# Altium schematic sheet OSSI-1 LED Controller_1.SchDoc: TITLE:
size 410 x 286 mm; Date: Date:; >LAST_DATE_TIME: 01/11/2015 13:36:10; Sheet:: Sheet:; >SHEET: 2; REV:: REV:; Document Number:: Document Number:; >DRAWING_NAME: OSSI-1 LED Controller.sch
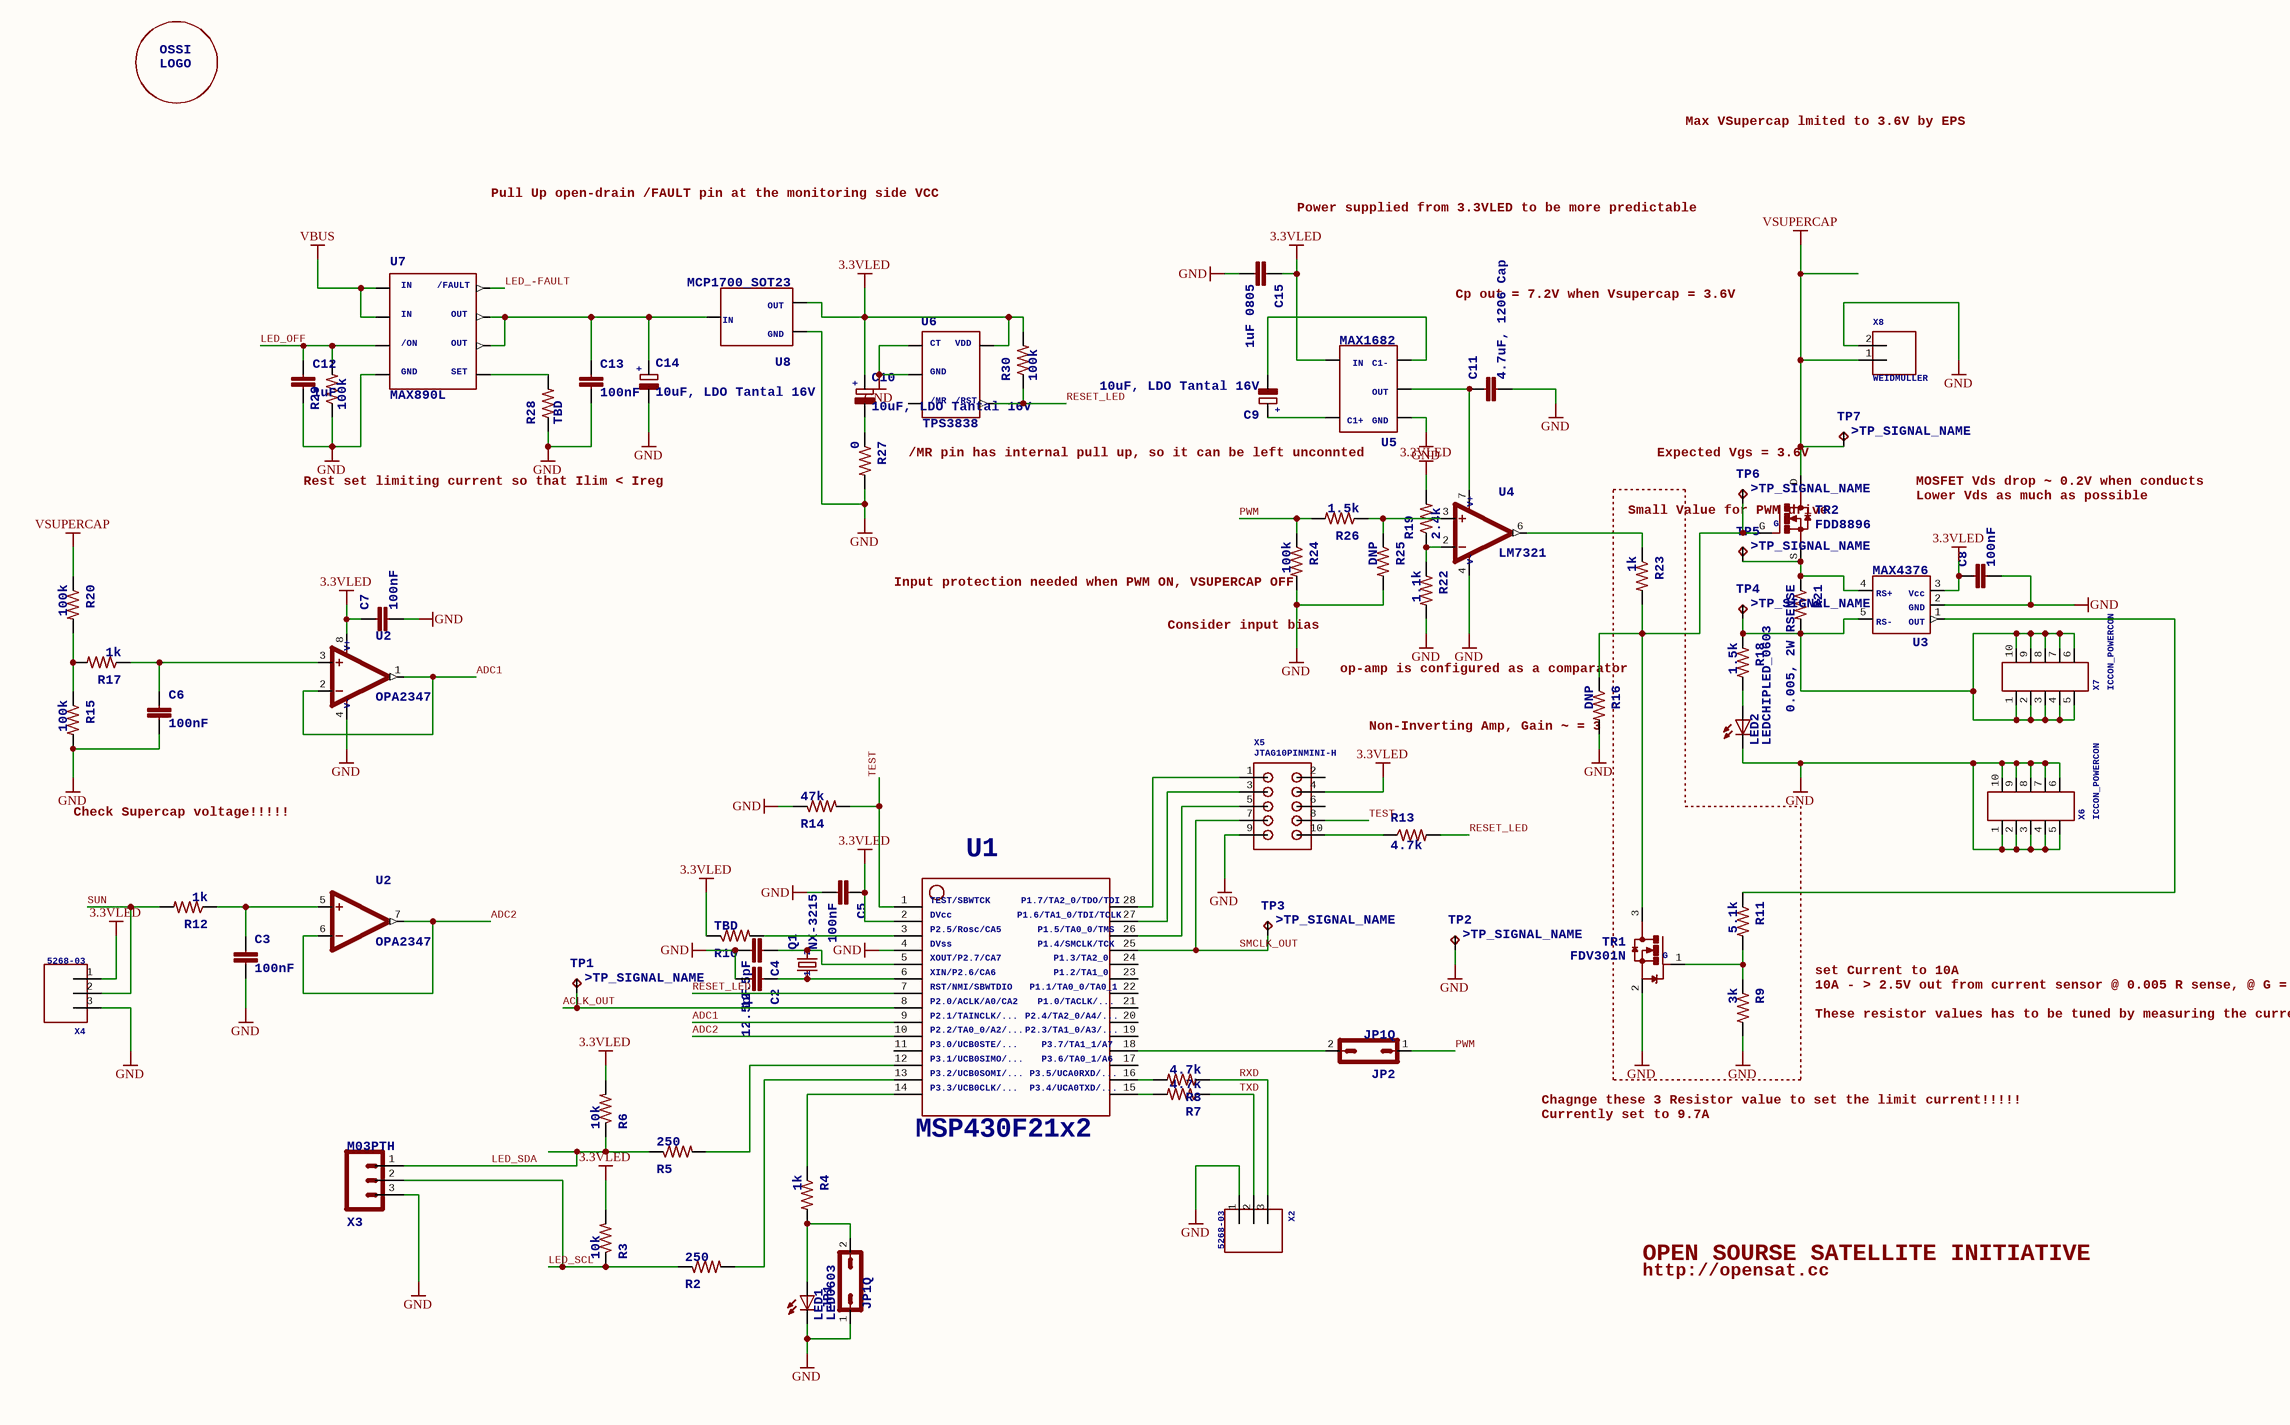
[diagram p0: OSSI-1 LED Controller_1.SchDoc]

## Parts
C2  >NAME: C2  [C0603(1608)]  (hidden comment: 12.5pF)
C3  >NAME: C3  [C0603(1608)]  (hidden comment: 100nF)
C4  >NAME: C4  [C0603(1608)]  (hidden comment: 12.5pF)
C5  >NAME: C5  [C0603(1608)]  (hidden comment: 100nF)
C6  >NAME: C6  [C0603(1608)]  (hidden comment: 100nF)
C7  >NAME: C7  [C0603(1608)]  (hidden comment: 100nF)
C8  >NAME: C8  [C0603(1608)]  (hidden comment: 100nF)
C9  >NAME: C9  [C1206(3216)-A]  (hidden comment: 10uF, LDO Tantal 16V)
C10  >NAME: C10  [C1206(3216)-A]  (hidden comment: 10uF, LDO Tantal 16V)
C11  >NAME: C11  [C1206-GCM31]  (hidden comment: 4.7uF, 1206 Cap)
C12  >NAME: C12  [C0603(1608)]  (hidden comment: 1uF)
C13  >NAME: C13  [C0603(1608)]  (hidden comment: 100nF)
C14  >NAME: C14  [C1206(3216)-A]  (hidden comment: 10uF, LDO Tantal 16V)
C15  >NAME: C15  [C0805(2012)]  (hidden comment: 1uF 0805)
JP1  JP1Q  [JP1]
JP2  >NAME: JP2  [JP1]  (hidden comment: JP1Q)
LED1  >NAME: LED1  [LED-0603]  (hidden comment: LED0603)
LED2  >NAME: LED2  [CHIPLED_0603]  (hidden comment: LEDCHIPLED_0603)
Q1  >NAME: Q1  [NX-3215]  (hidden comment: NX-3215)
R2  >NAME: R2  [R0603(1608)]  (hidden comment: 250)
R3  >NAME: R3  [R0603(1608)]  (hidden comment: 10k)
R4  >NAME: R4  [R0603(1608)]  (hidden comment: 1k)
R5  >NAME: R5  [R0603(1608)]  (hidden comment: 250)
R6  >NAME: R6  [R0603(1608)]  (hidden comment: 10k)
R7  >NAME: R7  [R0603(1608)]  (hidden comment: 4.7k)
R8  >NAME: R8  [R0603(1608)]  (hidden comment: 4.7k)
R9  >NAME: R9  [R0603(1608)]  (hidden comment: 3k)
R10  >NAME: R10  [R0603(1608)]  (hidden comment: TBD)
R11  >NAME: R11  [R0603(1608)]  (hidden comment: 5.1k)
R12  >NAME: R12  [R0603(1608)]  (hidden comment: 1k)
R13  >NAME: R13  [R0603(1608)]  (hidden comment: 4.7k)
R14  >NAME: R14  [R0603(1608)]  (hidden comment: 47k)
R15  >NAME: R15  [R0603(1608)]  (hidden comment: 100k)
R16  >NAME: R16  [R0603(1608)]  (hidden comment: DNP)
R17  >NAME: R17  [R0603(1608)]  (hidden comment: 1k)
R18  >NAME: R18  [R0603(1608)]  (hidden comment: 1.5k)
R19  >NAME: R19  [R0603(1608)]  (hidden comment: 2.4k)
R20  >NAME: R20  [R0603(1608)]  (hidden comment: 100k)
R21  >NAME: R21  [R4527(12070)]  (hidden comment: 0.005, 2W RSENSE)
R22  >NAME: R22  [R0603(1608)]  (hidden comment: 1.1k)
R23  >NAME: R23  [R0603(1608)]  (hidden comment: 1k)
R24  >NAME: R24  [R0603(1608)]  (hidden comment: 100k)
R25  >NAME: R25  [R0603(1608)]  (hidden comment: DNP)
R26  >NAME: R26  [R0603(1608)]  (hidden comment: 1.5k)
R27  >NAME: R27  [R0603(1608)]  (hidden comment: 0)
R28  >NAME: R28  [R0603(1608)]  (hidden comment: TBD)
R29  >NAME: R29  [R0603(1608)]  (hidden comment: 100k)
R30  >NAME: R30  [R0603(1608)]  (hidden comment: 100k)
TP1  >NAME: TP1  [TP-13]  (hidden comment: TP)
TP2  >NAME: TP2  [TP-13]  (hidden comment: TP)
TP3  >NAME: TP3  [TP-13]  (hidden comment: TP)
TP4  >NAME: TP4  [TP-13]  (hidden comment: TP)
TP5  >NAME: TP5  [TP-13]  (hidden comment: TP)
TP6  >NAME: TP6  [TP-13]  (hidden comment: TP)
TP7  >NAME: TP7  [TP-13]  (hidden comment: TP)
TR1  >NAME: TR1  [SOT23]  (hidden comment: FDV301N)
TR2  >NAME: TR2  [TO252]  (hidden comment: FDD8896)
U1  >NAME: U1  [PW28]  (hidden comment: MSP430F2132)
U2  >NAME: U2  [SOT23-8DCN]  (hidden comment: OPA2347)  (parts A,B of 2)
U3  >NAME: U3  [SOT23-5DBV]  (hidden comment: MAX4376)
U4  >NAME: U4  [SO8]  (hidden comment: LM7321)
U5  >NAME: U5  [SOT23-5DBV]  (hidden comment: MAX1682)
U6  >NAME: U6  [SOT23-5DBV]  (hidden comment: TPS3838)
U7  >NAME: U7  [SO8]  (hidden comment: MAX890L)
U8  >NAME: U8  [SOT23]  (hidden comment: MCP1700_SOT23)
U$  OSSILOGORECT  [OSSILOGORECT1005]  (value not drawn)
X2  >NAME: X2  [5268-03]  (hidden comment: 5268-03)
X3  >NAME: X3  [1X03]  (hidden comment: M03PTH)
X4  >NAME: X4  [5268-03]  (hidden comment: 5268-03)
X5  >NAME: X5  [M50-3200545]  (hidden comment: JTAG10PINMINI-H)
X6  >NAME: X6  [ICCON6643220-1]  (hidden comment: ICCON_POWERCON)
X7  >NAME: X7  [ICCON6643220-1]  (hidden comment: ICCON_POWERCON)
X8  >NAME: X8  [WEIDMULLER1760490000]  (hidden comment: WEIDMULLER)

## Blocks framed on the sheet
Small Value for PWM drive: R9 R11 R23 TR1

## Nets
3.3VLED: C5.1 C7.1 C8.1 C10.1(+) C15.1 R3.2 R6.2 R10.1 R19.2 R30.2 U1.2 U2.8(V+) U3.3(P$3) U5.4(P$4) U6.5(P$5) U8.2 X4.1 X5.4
GND: C2.2 C3.2 C4.2 C5.2 C6.2 C7.2 C8.2 C11.P$2 C12.2 C13.2 C14.2(-) C15.2 JP1.1 LED1.C LED2.C R9.2 R14.1 R15.2 R16.2 R22.2 R24.2 R25.2 R27.2 R28.1 R29.1 TP2.TP TR1.2(S) U1.4 U2.4(V-) U3.2(P$2) U4.4(V-) U5.1(P$1) U6.1(P$1) U6.2(P$2) U7.4(P$4) U8.1 X2.1 X3.3 X4.3 X5.9 X6.1(P$1) X6.2(P$2) X6.3(P$3) X6.4(P$4) X6.5(P$5) X6.6(P$6) X6.7(P$7) X6.8(P$8) X6.9(P$9) X6.10(P$10) X8.2
VBUS: U7.1(P$1) U7.2(P$2)
VSUPERCAP: R20.1 TP7.TP TR2.D X8.1
ACLK_OUT: TP1.TP U1.8
ADC1: U1.9 U2.1(OUT) U2.2(-IN)
ADC2: U1.10 U2.6(-IN) U2.7(OUT)
LED_-FAULT: U7.8(P$8)
LED_OFF: C12.1 R29.2 U7.3(P$3)
LED_SCL: R2.1 R3.1 X3.2
LED_SDA: R5.1 R6.1 X3.1
PWM: JP2.1 R24.1 R26.2
RESET_LED: R13.2 R30.1 U1.7 U6.4(P$4)
RXD: R8.1 X2.3
SMCLK_OUT: TP3.TP U1.25 X5.7
SUN: R12.2 X4.2
TEST: R14.2 U1.1 X5.8
TXD: R7.1 X2.2
NetC2_1: C2.1 Q1.1 U1.6
NetC3_1: C3.1 R12.1 U2.5(+IN)
NetC4_1: C4.1 Q1.2 U1.5
NetC6_1: C6.1 R17.1 U2.3(+IN)
NetC9_1: C9.1(+) U5.5(P$5)
NetC9_2: C9.2(-) U5.3(P$3)
NetC10_2: C10.2(-) R27.1
NetC11_P$1: C11.P$1 U4.7(V+) U5.2(P$2)
NetC13_1: C13.1 C14.1(+) U7.6(P$6) U7.7(P$7) U8.3
NetJP1_2: JP1.2 LED1.A R4.2
NetJP2_2: JP2.2 U1.18
NetLED2_A: LED2.A R18.2
NetR2_2: R2.2 U1.13
NetR4_1: R4.1 U1.14
NetR5_2: R5.2 U1.12
NetR7_2: R7.2 U1.15
NetR8_2: R8.2 U1.16
NetR9_1: R9.1 R11.2 TR1.1(G)
NetR10_2: R10.2 U1.3
NetR11_1: R11.1 U3.1(P$1)
NetR13_1: R13.1 X5.10
NetR15_1: R15.1 R17.2 R20.2
NetR16_1: R16.1 R23.2 TP6.TP TR1.3(D) TR2.G
NetR18_1: R18.1 R21.P$2 TP4.TP U3.5(P$5) X7.1(P$1) X7.2(P$2) X7.3(P$3) X7.4(P$4) X7.5(P$5) X7.6(P$6) X7.7(P$7) X7.8(P$8) X7.9(P$9) X7.10(P$10)
NetR19_1: R19.1 R22.1 U4.2(-IN)
NetR21_P$1: R21.P$1 TP5.TP TR2.S U3.4(P$4)
NetR23_1: R23.1 U4.6(OUT)
NetR25_1: R25.1 R26.1 U4.3(+IN)
NetR28_2: R28.2 U7.5(P$5)
NetU1_26: U1.26 X5.5
NetU1_27: U1.27 X5.3
NetU1_28: U1.28 X5.1

Not connected (* = marked no-connect by the designer): U1 11 17 19 20 21 22 23 24; U6 3(P$3); X5 2 6

## Notes on the sheet
- Max VSupercap lmited to 3.6V by EPS
- Pull Up open-drain /FAULT pin at the monitoring side VCC
- Power supplied from 3.3VLED to be more predictable
- Cp out = 7.2V when Vsupercap = 3.6V
- Rest set limiting current so that Ilim < Ireg
- /MR pin has internal pull up, so it can be left unconnted
- Expected Vgs = 3.6V
- MOSFET Vds drop ~ 0.2V when conducts
- Lower Vds as much as possible
- Input protection needed when PWM ON, VSUPERCAP OFF
- (near R24) Consider input bias
- (near R16) op-amp is configured as a comparator
- (near R16) Non-Inverting Amp, Gain ~ = 3
- Check Supercap voltage!!!!!
- set Current to 10A
- 10A - > 2.5V out from current sensor @ 0.005 R sense, @ G = 50
- These resistor values has to be tuned by measuring the currents
- Chagnge these 3 Resistor value to set the limit current!!!!!
- Currently set to 9.7A
- OPEN SOURSE SATELLITE INITIATIVE
- http://opensat.cc

## Library data of the parts
C2-C8 C12 C13 = C0603(1608)
  C2 C4: >VALUE: 12.5pF
  C3 C5-C8 C13: >VALUE: 100nF
  C12: >VALUE: 1uF
C9 C10 C14 = C-TANTAL-A: <b>TAJA105M020RNJ</b> / <ul> / <li>Tantal Capacitor / </li> / <li>Manufacturer: AVX / </li> / <li>1206(3126) / </li> / <li>Ref: www.avx.com/docs/techinfo/tantappl.pdf</li> / </ul>; +: +; >VALUE: 10uF, LDO Tantal 16V
C11 = C1206(3216)-GCM31: >VALUE: 4.7uF, 1206 Cap
C15 = C0805(2012): >VALUE: 1uF 0805
JP1 JP2 = JP1Q: <b>JUMPER</b>; >VALUE: JP1Q
  JP1: >NAME: JP1
LED1 = LED0603: <b>LEDs</b> / Standard schematic elements and footprints for 5mm, 3mm, 1206, and 0603 sized LEDs. 5mm - Spark Fun Electronics SKU : COM-00529 (and others); >VALUE: LED0603
LED2 = LEDCHIPLED_0603: <b>LED</b><p> / <u>OSRAM</u>:<br> / - <u>CHIPLED</u><br> / LG R971, LG N971, LY N971, LG Q971, LY Q971, LO R971, LY R971 / LH N974, LH R974<br> / LS Q976, LO Q976, LY Q976<br> / LO Q996<br> / - <u>Hyper CHIPLED</u><br> / LW Q18S<br> / LB Q993, LB Q99A, LB R99A<br> / - <u>SideLED</u><br> / LS A670, LO A670, LY A670, LG A670, LP A670<br> / LB A673, LV A673, LT A673, LW A673<br> / LH A674<br> / LY A675<br> / LS A676, LA A676, LO A676, LY A676, LW A676<br> / LS A679, LY A679, LG A679<br> / -  <u>Hyper Micro SIDELED®</u><br> / LS Y876, LA Y876, LO Y876, LY Y876<br> / LT Y87S<br> / - <u>SmartLED</u><br> / LW L88C, LW L88S<br> / LB L89C, LB L89S, LG L890<br> / LS L89K, LO L89K, LY L89K<br> / LS L896, LA L896, LO L896, LY L896<br> / - <u>TOPLED</u><br> / LS T670, LO T670, LY T670, LG T670, LP T670<br> / LSG T670, LSP T670, LSY T670, LOP T670, LYG T670<br> / LG T671, LOG T671, LSG T671<br> / LB T673, LV T673, LT T673, LW T673<br> / LH T674<br> / LS T676, LA T676, LO T676, LY T676, LB T676, LH T676, LSB T676, LW T676<br> / LB T67C, LV T67C, LT T67C, LS T67K, LO T67K, LY T67K, LW E67C<br> / LS E67B, LA E67B, LO E67B, LY E67B, LB E67C, LV E67C, LT E67C<br> / LW T67C<br> / LS T679, LY T679, LG T679<br> / LS T770, LO T770, LY T770, LG T770, LP T770<br> / LB T773, LV T773, LT T773, LW T773<br> / LH T774<br> / LS E675, LA E675, LY E675, LS T675<br> / LS T776, LA T776, LO T776, LY T776, LB T776<br> / LHGB T686<br> / LT T68C, LB T68C<br> / - <u>Hyper Mini TOPLED®</u><br> / LB M676<br> / - <u>Mini TOPLED Santana®</u><br> / LG M470<br> / LS M47K, LO M47K, LY M47K / <p> / Source: http://www.osram.convergy.de<p> / <u>LUXEON:</u><br> / - <u>LUMILED®</u><br> / LXK2-PW12-R00, LXK2-PW12-S00, LXK2-PW14-U00, LXK2-PW14-V00<br> / LXK2-PM12-R00, LXK2-PM12-S00, LXK2-PM14-U00<br> / LXK2-PE12-Q00, LXK2-PE12-R00, LXK2-PE12-S00, LXK2-PE14-T00, LXK2-PE14-U00<br> / LXK2-PB12-K00, LXK2-PB12-L00, LXK2-PB12-M00, LXK2-PB14-N00, LXK2-PB14-P00, LXK2-PB14-Q00<br> / LXK2-PR12-L00, LXK2-PR12-M00, LXK2-PR14-Q00, LXK2-PR14-R00<br> / LXK2-PD12-Q00, LXK2-PD12-R00, LXK2-PD12-S00<br> / LXK2-PH12-R00, LXK2-PH12-S00<br> / LXK2-PL12-P00, LXK2-PL12-Q00, LXK2-PL12-R00 / <p> / Source: www.luxeon.com<p> / <u>KINGBRIGHT:</U><p> / KA-3528ASYC<br> / Source: www.kingbright.com; >VALUE: LEDCHIPLED_0603
Q1 = NX-3215: NDK 32.768 kHz SMD Crystal<br /> / P/N: NX3215SA-32.768K-STD-MUA-9<br /> / <br /> / <b>Nominal frequency (kHz):</b> 32.768 <br/> / <b>Package Size (L×W×H : mm):</b>  3.2×1.5×0.8 <br/> / <b>Operating Temperature Range(*1)  /  Storage Temperature Range   (°C):</b>  -40 to +85  /  -40 to +85<br/> / <b>Level of drive:</b>   0.1µW (Max. 0.5µW) <br/> / <b>Frequency Tolerance (25±3°C):</b>  ±20×10-6 <br/> / <b>Load Capacitance:</b>  9.0pF, 12.5pF <br/> / <b>Equivalent Series Resistance:</b>  70kΩ Max.<br/> / <b>Ordering Code:</b>  NX3215SA-32.768K-STD-MUA-9 (Load Capacitance9.0pF) /NX3215SA-32.768K-STD-MUA-8 (Load Capacitance12.5pF); >VALUE: NX-3215; 1: 1; 2: 2
R2-R20 R22-R30 = R0603(1608)
  R2 R5: >VALUE: 250
  R3 R6: >VALUE: 10k
  R4 R12 R17 R23: >VALUE: 1k
  R7 R8 R13: >VALUE: 4.7k
  R9: >VALUE: 3k
  R10 R28: >VALUE: TBD
  R11: >VALUE: 5.1k
  R14: >VALUE: 47k
  R15 R20 R24 R29 R30: >VALUE: 100k
  R16 R25: >VALUE: DNP
  R18 R26: >VALUE: 1.5k
  R19: >VALUE: 2.4k
  R22: >VALUE: 1.1k
  R27: >VALUE: 0
R21 = RWSR2: >VALUE: 0.005, 2W RSENSE
TR1 = FDV301N: FDV301N Digital N channel - FET / Rdson = 5 Ohm / Vgs = 0.7~1.06V / Ids = 220mA; G: G; >VALUE: FDV301N
TR2 = FDD8896: FDD8896<br/> / N-Channel PowerTrench ® MOSFET; G: G; >VALUE: FDD8896
U1 = MSP430F2132: *** MSP430F21x2 *** PW28; TEST/SBWTCK: TEST/SBWTCK; DVcc: DVcc; P2.5/Rosc/CA5: P2.5/Rosc/CA5; DVss: DVss; XOUT/P2.7/CA7: XOUT/P2.7/CA7; XIN/P2.6/CA6: XIN/P2.6/CA6; RST/NMI/SBWTDIO: RST/NMI/SBWTDIO; P2.0/ACLK/A0/CA2: P2.0/ACLK/A0/CA2; P2.1/TAINCLK/...: P2.1/TAINCLK/...; P2.2/TA0_0/A2/...: P2.2/TA0_0/A2/...; P1.7/TA2_0/TDO/TDI: P1.7/TA2_0/TDO/TDI; P1.6/TA1_0/TDI/TCLK: P1.6/TA1_0/TDI/TCLK; P1.5/TA0_0/TMS: P1.5/TA0_0/TMS; P1.4/SMCLK/TCK: P1.4/SMCLK/TCK; P1.3/TA2_0: P1.3/TA2_0; P1.2/TA1_0: P1.2/TA1_0; P1.1/TA0_0/TA0_1: P1.1/TA0_0/TA0_1; P1.0/TACLK/...: P1.0/TACLK/...; P2.4/TA2_0/A4/...: P2.4/TA2_0/A4/...; P2.3/TA1_0/A3/...: P2.3/TA1_0/A3/...; MSP430F21x2: MSP430F21x2; P3.7/TA1_1/A7: P3.7/TA1_1/A7; P3.6/TA0_1/A6: P3.6/TA0_1/A6; P3.5/UCA0RXD/...: P3.5/UCA0RXD/...; P3.4/UCA0TXD/...: P3.4/UCA0TXD/...; P3.3/UCB0CLK/...: P3.3/UCB0CLK/...; P3.2/UCB0SOMI/...: P3.2/UCB0SOMI/...; P3.1/UCB0SIMO/...: P3.1/UCB0SIMO/...; P3.0/UCB0STE/...: P3.0/UCB0STE/...
U2 = OPA2347: <b>OPA2347</b> / <ul> / <li>RAIL-TO-RAIL INPUT AND OUTPUT</li> / <li>SINGLE SUPPLY: 2.3V to 5.5V</li> / <li>LOW IQ: 20µ</li> / </ul>; >VALUE: OPA2347; V+: V+; V-: V-
U4 = LM7321: LM7321<br /> / Rail-to-Rail Input/Output ±15V, High Output Current and Unlimited Capacitive Load Operational Amplifier<br /> / Texas Intrument; >VALUE: LM7321; V+: V+; V-: V-
U5 = MAX1682: MAX1682EUK+T Charge Pump; >VALUE: MAX1682; GND: GND; C1-: C1-; OUT: OUT; C1+: C1+; IN: IN
U6 = TPS3838: <b>TPS3838</b> / <br /> / NanoPower Supervisory IC from texas instruments.<br /> / TPS3838 is open-drain output; >VALUE: TPS3838; CT: CT; /MR: /MR; GND: GND; VDD: VDD; /RST: /RST
U7 = MAX890L: <B>MAX 890L</B> / <BR /> / 1.2A, Current-Limited, High-Side / P-Channel Switch with Thermal Shutdown BY MAXIM; IN: IN; /ON: /ON; GND: GND; SET: SET; OUT: OUT; /FAULT: /FAULT; >VALUE: MAX890L
U8 = MCP1700_SOT23: MCP1700 LDO from Microchips; >VALUE: MCP1700_SOT23; IN: IN; GND: GND; OUT: OUT
X3 = M03PTH: <b>Header 3</b> / Standard 3-pin 0.1" header. Use with straight break away headers (SKU : PRT-00116), right angle break away headers (PRT-00553), swiss pins (PRT-00743), machine pins (PRT-00117), and female headers (PRT-00115). Molex polarized connector foot print use with SKU : PRT-08232 with associated crimp pins and housings.; >VALUE: M03PTH
TP1-TP7 = TP: >TP_SIGNAL_NAME: >TP_SIGNAL_NAME
U3 = MAX4376: >VALUE: MAX4376; OUT: OUT; GND: GND; Vcc: Vcc; RS+: RS+; RS-: RS-
U$ = OSSILOGORECT: OSSI: OSSI; LOGO: LOGO
X2 X4 = 5268-03: >VALUE: 5268-03
X5 = JTAG10PINMINI-H: >VALUE: JTAG10PINMINI-H
X6 X7 = ICCON_POWERCON: >VALUE: ICCON_POWERCON
X8 = WEIDMULLER: >VALUE: WEIDMULLER